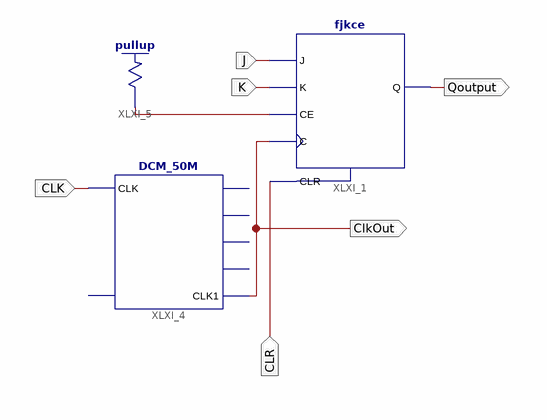
[diagram p0: schematic sheet 1]
// Xilinx ISE schematic lab7exp10.sch (spartan3e) as structural Verilog: 3 symbols, 6 ports
module lab7exp10 (
  input  CLK,
  input  J,
  input  K,
  input  CLR,
  output Qoutput,
  output ClkOut
);

  wire XLXN_10;

  fjkce XLXI_1 (.C(ClkOut), .CE(XLXN_10), .CLR(CLR), .J(J), .K(K), .Q(Qoutput));
  DCM_50M XLXI_4 (.CLK(CLK), .CLK1(ClkOut));  // open: RST, CLK1M, CLK10k, CLK1k, CLK100
  \pullup  XLXI_5 (.O(XLXN_10));
endmodule
